# EAGLE design templog3 (EAGLE 9.5.1)
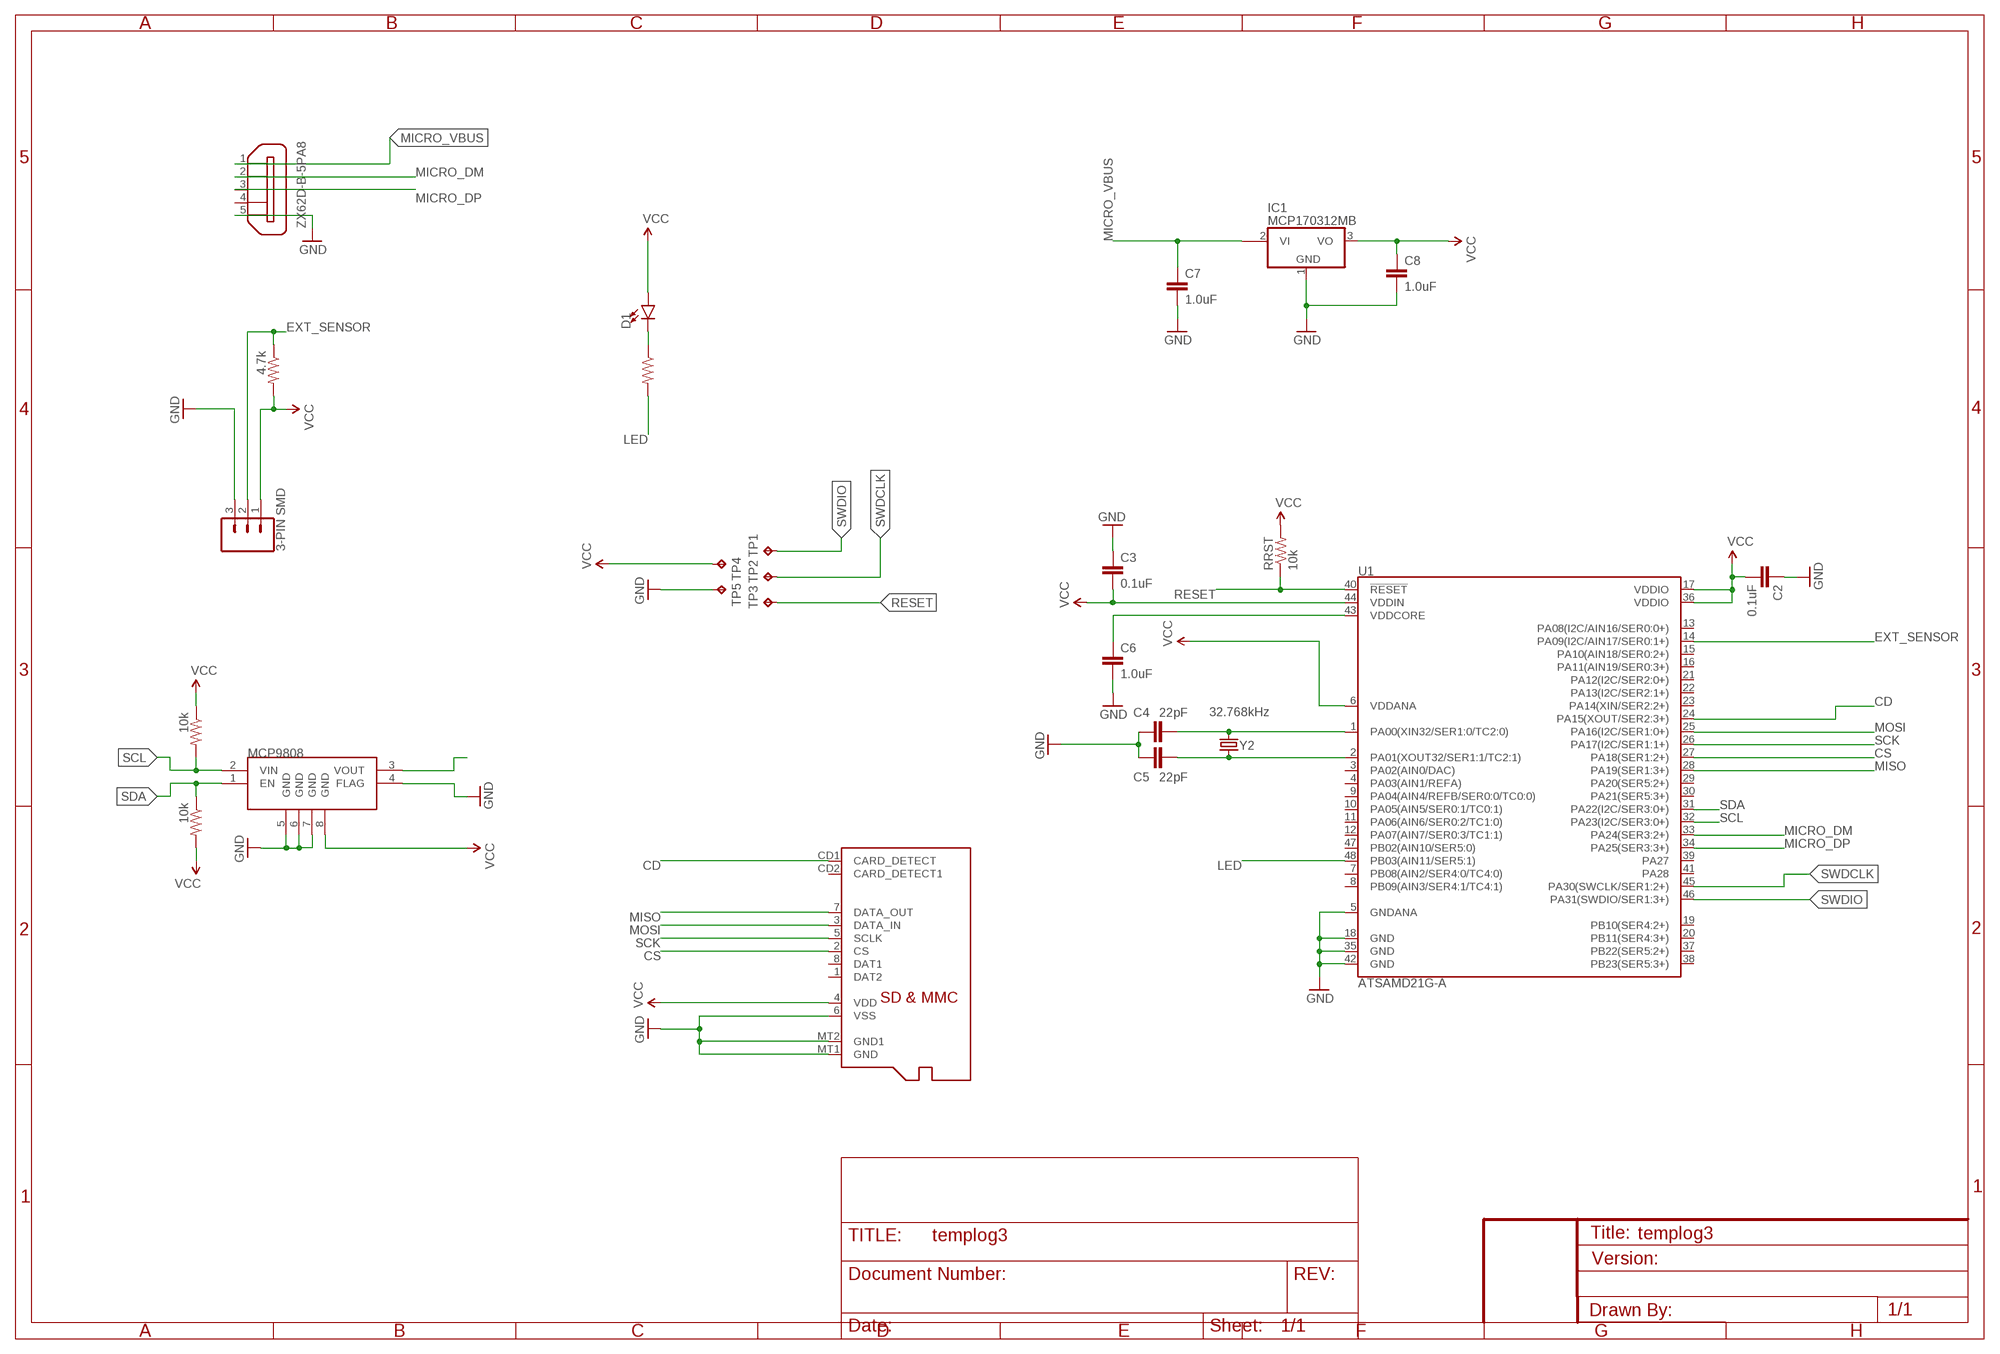
[diagram p0: schematic, sheet 1]

## Parts
C2  0.1uF  1.0UF-0805-25V-10%  [0805]
C3  0.1uF  1.0UF-0805-25V-10%  [0805]
C4  22pF  CAP0805  [0805]
C5  22pF  CAP0805  [0805]
C6  1.0uF  1.0UF-0805-25V-10%  [0805]
C7  1.0uF  1.0UF-0805-25V-10%  [0805]
C8  1.0uF  1.0UF-0805-25V-10%  [0805]
D1  LED1206  [LED-1206]
IC1  MCP170312MB  [SOT89]
J2  3-PIN SMD  CONN_03JST-SMD  [JST-3-SMD]
MCP9808  V_REG_MIC5216  [MSOP8]
R_I2C_1  10k  RESISTOR0805-RES  [0805]
R_I2C_2  10k  RESISTOR0805-RES  [0805]
R_I2C_3  4.7k  RESISTOR0805-RES  [0805]
R_I2C_4  RESISTOR0805-RES  [0805]
RRST  10k  RESISTOR0805-RES  [0805]
TP1  TPB1,27  [B1,27]
TP2  TPB1,27  [B1,27]
TP3  TPB1,27  [B1,27]
TP4  TPB1,27  [B1,27]
TP5  TPB1,27  [B1,27]
U1  ATSAMD21G-A  [TQFP-48]
U$1  MICROSD  [MICROSD]
X2  ZX62D-B-5PA8  [ZX62D-B-5PA8]
Y2  32.768kHz  CRYSTAL3.2X1.5MM  [CRYSTAL-SMD-3.2X1.5MM]

## Nets
CD: U1.24(PA15(XOUT/SER2:3+)) U$1.CD1(CARD_DETECT)
CS: U1.27(PA18(SER1:2+)) U$1.2(CS)
EXT_SENSOR: J2.2 R_I2C_3.1 U1.14(PA09(I2C/AIN17/SER0:1+))
GND: C2.1 C3.1 C4.1 C5.1 C6.2 C7.2 C8.2 IC1.1(GND) J2.3 MCP9808.4(FLAG) MCP9808.5(GND) MCP9808.6(GND) MCP9808.7(GND) TP5.TP U1.5(GNDANA) U1.18(GND) U1.35(GND) U1.42(GND) U$1.6(VSS) U$1.MT1(GND) U$1.MT2(GND1) X2.5
LED: R_I2C_4.2 U1.48(PB03(AIN11/SER5:1))
MICRO_DM: U1.33(PA24(SER3:2+)) X2.2
MICRO_DP: U1.34(PA25(SER3:3+)) X2.3
MICRO_VBUS: C7.1 IC1.2@1(VI1) X2.1
MISO: U1.28(PA19(SER1:3+)) U$1.7(DATA_OUT)
MOSI: U1.25(PA16(I2C/SER1:0+)) U$1.3(DATA_IN)
N$1: C6.1 U1.43(VDDCORE)
N$4: MCP9808.3(VOUT)
N$5: D1.C R_I2C_4.1
N$8: C4.2 U1.1(PA00(XIN32/SER1:0/TC2:0)) Y2.P$2
N$32: C5.2 U1.2(PA01(XOUT32/SER1:1/TC2:1)) Y2.P$1
RESET: RRST.1 TP3.TP U1.40(!RESET!)
SCK: U1.26(PA17(I2C/SER1:1+)) U$1.5(SCLK)
SCL: MCP9808.2(VIN) R_I2C_1.2 U1.32(PA23(I2C/SER3:0+))
SDA: MCP9808.1(EN) R_I2C_2.1 U1.31(PA22(I2C/SER3:0+))
SWDCLK: TP2.TP U1.45(PA30(SWCLK/SER1:2+))
SWDIO: TP1.TP U1.46(PA31(SWDIO/SER1:3+))
VCC [power]: C2.2 C3.2 C8.1 D1.A IC1.3(VO) J2.1 MCP9808.8(GND) R_I2C_1.1 R_I2C_2.2 R_I2C_3.2 RRST.2 TP4.TP U1.6(VDDANA) U1.17(VDDIO) U1.36(VDDIO) U1.44(VDDIN) U$1.4(VDD)
Unconnected: IC1.2(VI) U1.3(PA02(AIN0/DAC)) U1.4(PA03(AIN1/REFA)) U1.7(PB08(AIN2/SER4:0/TC4:0)) U1.8(PB09(AIN3/SER4:1/TC4:1)) U1.9(PA04(AIN4/REFB/SER0:0/TC0:0)) U1.10(PA05(AIN5/SER0:1/TC0:1)) U1.11(PA06(AIN6/SER0:2/TC1:0)) U1.12(PA07(AIN7/SER0:3/TC1:1)) U1.13(PA08(I2C/AIN16/SER0:0+)) U1.15(PA10(AIN18/SER0:2+)) U1.16(PA11(AIN19/SER0:3+)) U1.19(PB10(SER4:2+)) U1.20(PB11(SER4:3+)) U1.21(PA12(I2C/SER2:0+)) U1.22(PA13(I2C/SER2:1+)) U1.23(PA14(XIN/SER2:2+)) U1.29(PA20(SER5:2+)) U1.30(PA21(SER5:3+)) U1.37(PB22(SER5:2+)) U1.38(PB23(SER5:3+)) U1.39(PA27) U1.41(PA28) U1.47(PB02(AIN10/SER5:0)) U$1.1(DAT2) U$1.8(DAT1) U$1.CD2(CARD_DETECT1) X2.4 X2.S1 X2.S2 X2.S3 X2.S4

## Library data of the parts
C2 C3 = SparkFun-Capacitors:1.0UF: 1µF ceramic capacitors A capacitor is a passive two-terminal electrical component used to store electrical energy temporarily in an electric field.; PROD_ID: CAP-08064; VALUE: 1.0uF
C4 C5 = SparkFun-Passives:CAP: Capacitor Standard 0603 ceramic capacitor, and 0.1" leaded capacitor.
C6-C8 = SparkFun-Capacitors:1.0UF: 1µF ceramic capacitors A capacitor is a passive two-terminal electrical component used to store electrical energy temporarily in an electric field.; PROD_ID: CAP-08064
D1 = SparkFun-LED:LED: LED (Generic) Standard schematic elements and footprints for 5mm, 3mm, 1206, and 0603 sized LEDs. Generic LEDs with no color specified.
IC1 = linear:MCP1703*: 250 mA, 16V, Low Quiescent Current LDO Regulator Source: http://ww1.microchip.com/downloads/en/DeviceDoc/22049b.pdf
J2 = SparkFun-Connectors:CONN_03: Multi connection point. Often used as Generic Header-pin footprint for 0.1 inch spaced/style header connections On any of the 0.1 inch spaced packages, you can populate with these: Break Away Headers - Straight <https://www.sparkfun.com/products/116> (PRT-00116) Break Away Male Headers - Right Angle <https://www.sparkfun.com/products/553> (PRT-00553) Female Headers <https://www.sparkfun.com/products/115> (PRT-00115) Break Away Headers - Machine Pin <https://www.sparkfun.com/products/117> (PRT-00117) Break Away Female Headers - Swiss Machine Pin <https://www.sparkfun.com/products/743> (PRT-00743) Stackable Header - 3 Pin (Female, 0.1") <https://www.sparkfun.com/products/13875> (PRT-13875) For SCREWTERMINALS and SPRING TERMINALS visit here: Screw Terimnals on SparkFun.com <https://www.sparkfun.com/search/results?term=Screw+Terminals> (5mm/3.5mm/2.54mm spacing) This device is also useful as a general connection point to wire up your design to another part of your project. Our various solder wires solder well into these plated through hole pads. Hook-Up Wire - Assortment (Stranded, 22 AWG) <https://www.sparkfun.com/products/11375> (PRT-11375) Hook-Up Wire - Assortment (Solid Core, 22 AWG) <https://www.sparkfun.com/products/11367> (PRT-11367) View the entire wire category on our website here <https://www.sparkfun.com/categories/141> Special notes: Molex polarized connector foot print use with SKU : PRT-08232 with associated crimp pins and housings.; PROD_ID: CONN-12591
MCP9808 = SparkFun-IC-Power:V_REG_MIC5216: 500mA LDO, MSOP8 for better dissipation; PROD_ID: IC-09527
R_I2C_1-R_I2C_4 RRST = SparkFun-Passives:RESISTOR: Resistor Basic schematic elements and footprints for 0603, 1206, and PTH resistors.
TP1-TP5 = testpad:TP: Test pad
U1 = SparkFun-IC-Microcontroller:ATSAMD21G: Atmel SAMD21G SMART ARM-Based Microcontroller The Atmel ® | SMART ™ SAM D21 is a series of low-power microcontrollers using the 32-bit ARM ® Cortex ® -M0+ processor, and ranging from 32- to 64-pins with up to 256KB Flash and 32KB of SRAM. The SAM D21 devices operate at a maximum frequency of 48MHz and reach 2.46 CoreMark/MHz. They are designed for simple and intuitive migration with identical peripheral modules, hex compatible code, identical linear address map and pin compatible migration paths between all devices in the product series. All devices include intelligent and flexible peripherals, Atmel Event System for inter-peripheral signaling, and support for capacitive touch button, slider and wheel user interfaces. Datasheet <https://cdn.sparkfun.com/datasheets/Dev/Arduino/Boards/Atmel-42181-SAM-D21_Datasheet.pdf> SparkFun Products SparkFun SAMD21 Mini Breakout <https://www.sparkfun.com/products/13664> (DEV-13664) SparkFun SAMD21 Dev Breakout <https://www.sparkfun.com/products/13672> (DEV-13672); PROD_ID: IC-13064
U$1 = adafruit:MICROSD: Micro-SD / Transflash card holder with SPI pinout For the 3M # 2908-05WB-MG and/or 4UCON #19656 push-push type
X2 = zx62d-b-5pa8-oshpark_10:ZX62D-B-5PA8: Micro USB Type B Connector - Standard, Shell Through Hole Source: http://www.hirose.co.jp/cataloge_hp/ed_ZX_20140804.pdf; MF: Hirose; MPN: ZX62D-B-5PA8; OC_FARNELL: 2300438; OC_NEWARK: 69W0712
Y2 = samd21-temp:CRYSTAL: Various standard crystals. Proven footprints.; PROD_ID: XTAL-13062

## Net classes
0 default: width 0.203 mm, clearance 0.152 mm
1 power: width 0.254 mm, clearance 0.203 mm
2 camera_power: width 0.66 mm, clearance 0.254 mm
3 usbsignal: width 0.254 mm, clearance 0.203 mm
4 highpower: clearance 0.305 mm

## Board
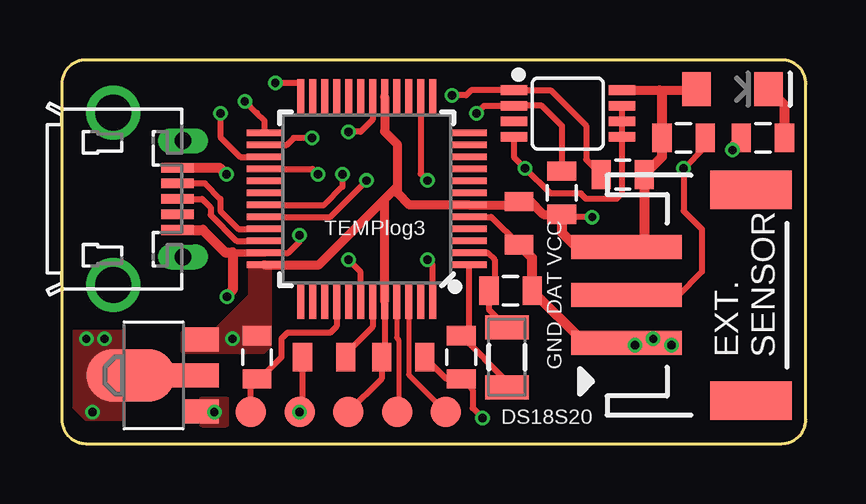
[diagram p1: board, top side]
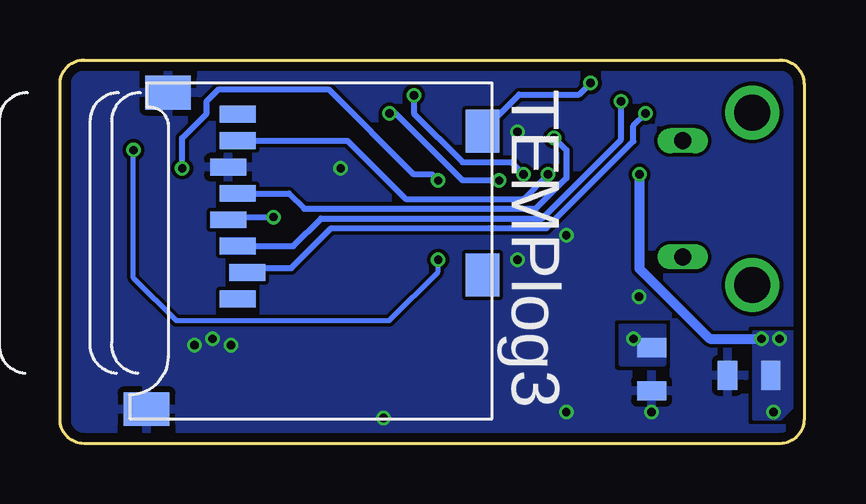
[diagram p2: board, bottom side, seen from below]

Size 31 x 16 mm. Coordinates in mm from the lower left corner, seen from the top.
Outline: 1,0 30,0 arc90 31,1 31,15 arc90 30,16 1,16 arc90 0,15 0,1 arc90 1,0
Copper layers (1*16): Top 0.035559375mm / dielectric 1.6mm / Bottom 0.035559375mm
Design rules "oshpark-2layer": minimum track width 6mil, minimum drill 10mil, track to track 6mil, track to pad 6mil, pad to pad 6mil, via to via 6mil, smd to smd 6mil, copper to edge 15mil, drill to drill 6mil, minimum pad ring 5mil, minimum via ring 5mil, stop-mask expansion 2.5mil, vias tented up to drill 0mil, thermal gap 10mil

### Footprints (pad centres in the part's own frame; a part is rotated, then mirrored left to right if it is on the bottom)
0805 = smd 0.8 x 1.2: 1 -0.9,0; 2 0.9,0
LED-1206 = smd 1.2 x 1.4: A -1.5,0; C 1.5,0
SOT89 = smd 1 x 1.5: 1 -1.499,-1.981; 3 1.499,-1.981 | smd 1 x 2: 2 0,-1.727 | smd 2.2 x 3.7: 2@1 0,0.94
JST-3-SMD = smd 1 x 4.6: 1 -1.99,-4.77; 2 0.01,-4.77; 3 2.01,-4.77 | smd 1.6 x 3.4: NC1 -4.39,0.43; NC2 4.41,0.43
MSOP8 = smd 0.4 x 1.1: 1 -0.975,-2.25; 2 -0.325,-2.25; 3 0.325,-2.25; 4 0.975,-2.25; 5 0.975,2.25; 6 0.325,2.25; 7 -0.325,2.25; 8 -0.975,2.25
B1,27 = smd 1.27 x 1.27: TP 0,0
TQFP-48 = smd 1.5 x 0.28: 1 -4.25,2.75; 2 -4.25,2.25; 3 -4.25,1.75; 4 -4.25,1.25; 5 -4.25,0.75; 6 -4.25,0.25; 7 -4.25,-0.25; 8 -4.25,-0.75; 9 -4.25,-1.25; 10 -4.25,-1.75; 11 -4.25,-2.25; 12 -4.25,-2.75; 25 4.25,-2.75; 26 4.25,-2.25; 27 4.25,-1.75; 28 4.25,-1.25; 29 4.25,-0.75; 30 4.25,-0.25; 31 4.25,0.25; 32 4.25,0.75; 33 4.25,1.25; 34 4.25,1.75; 35 4.25,2.25; 36 4.25,2.75 | smd 0.28 x 1.5: 13 -2.75,-4.25; 14 -2.25,-4.25; 15 -1.75,-4.25; 16 -1.25,-4.25; 17 -0.75,-4.25; 18 -0.25,-4.25; 19 0.25,-4.25; 20 0.75,-4.25; 21 1.25,-4.25; 22 1.75,-4.25; 23 2.25,-4.25; 24 2.75,-4.25; 37 2.75,4.25; 38 2.25,4.25; 39 1.75,4.25; 40 1.25,4.25; 41 0.75,4.25; 42 0.25,4.25; 43 -0.25,4.25; 44 -0.75,4.25; 45 -1.25,4.25; 46 -1.75,4.25; 47 -2.25,4.25; 48 -2.75,4.25
MICROSD = smd 0.7 x 1.5: 1 9,-10.64; 2 7.9,-10.24; 3 6.8,-10.64; 4 5.7,-11.04; 5 4.6,-10.64; 6 3.5,-11.04; 7 2.4,-10.64; 8 1.3,-10.64 | smd 1.8 x 1.4: CD1 2,-0.44; CD2 8,-0.44 | smd 1.4 x 1.9: MT1 0.4,-13.54; MT2 13.6,-14.44
ZX62D-B-5PA8 = smd 1.35 x 0.4: 1 4.825,1.3; 2 4.825,0.65; 3 4.825,0; 4 4.825,-0.65; 5 4.825,-1.3 | drill 1.5: S1 2.15,-3.6; S2 2.15,3.6 | drill 0.7 long: S3 5.05,2.425; S4 5.05,-2.425
CRYSTAL-SMD-3.2X1.5MM = smd 1 x 1.8: P$1 -1.25,0; P$2 1.25,0

### Placement (x,y rotation side)
C2  14.22,3.6 180 top
C3  19.05,9.19 90 top
C4  16.64,3.6 90 top
C5  18.7,6.37 180 top
C6  10.92,3.6 180 top
C7  2.29,2.84 180 bottom
C8  6.35,3.1 270 bottom
D1  27.94,14.78 0 top
IC1  3.81,2.84 90 top
J2  28.29,6.2 270 top
MCP9808  21.08,13.76 270 top
R_I2C_1  20.83,10.46 90 top
R_I2C_2  23.37,11.22 0 top
R_I2C_3  25.91,12.75 180 top
R_I2C_4  29.21,12.75 180 top
RRST  8.13,3.6 90 top
TP1  16,1.32 180 top
TP2  13.97,1.32 180 top
TP3  7.87,1.32 180 top
TP4  11.94,1.32 180 top
TP5  9.91,1.32 180 top
U1  12.7,10.21 180 top
U$1  12.95,15.03 270 bottom
X2  0,10.21 0 top
Y2  18.54,3.6 270 top

### Tracks (layer width: path | path; a pad name or v marks a point on that pad's centre or on a via)
CD  (via drill 0.35)
  Top 0.254: U1.24 9.95,15.03 v8.89,15.03
  Bottom 0.254: v8.89,15.03 9.37,14.56 11.87,14.56 U$1.CD1
CS  (via drill 0.35)
  Top 0.254: v6.6,13.76 6.6,12.78 7.43,11.96 U1.27
  Bottom 0.254: U$1.2 23.01,7.32 21.36,7.32 19.69,8.99 10.74,8.99 7.11,12.62 7.11,13.26 v6.6,13.76
EXT_SENSOR  (via drill 0.35)
  Top 0.254: U1.14 14.95,11.26 v15.24,10.97 | R_I2C_3.1 26.81,12.38 v25.91,11.48 25.91,9.7 26.67,8.94 26.67,7.16 25.65,6.14 23.56,6.14 J2.2
  Bottom 0.254: v15.24,10.97 15.49,11.22 16.26,11.22 19.81,14.78 24.38,14.78 24.89,14.27 24.89,13.76 25.91,12.75 v25.91,11.48
GND  (via drill 0.35)
  Top 0.254: C6.2 10.02,1.43 TP5.TP | U1.42 12.45,7.16 v11.94,7.67 | MCP9808.7 MCP9808.6 MCP9808.5 23.33,10.43 23.11,10.21 21.84,10.21 21.62,10.43 20.37,10.43 19.32,11.48 v19.3,11.48 18.83,11.95 MCP9808.4 | U1.5 17.88,9.46 C3.1 | C2.1 16.02,2.7 C4.1 17.11,2.23 17.11,1.48 v17.53,1.06 | U1.35 9.43,7.96 9.91,8.43 v9.91,8.68 | U1.18 12.95,13.51 12.45,13 v11.94,13
  Top 0.305: U1.35 7.13,7.96 7.11,7.97
  Top 0.406: X2.5 5.87,8.91 6.8,7.97 7.11,7.97 7.11,6.4 6.87,6.16 v6.87,6.13 | C3.1 19.6,7.75 C5.1 21.78,4.19 J2.3 23.8,4.19 v23.88,4.11
  other vias: 9.91,1.32 6.35,1.32 25.4,4.11 24.64,4.37
  pour Bottom (rank 2): 0,0.3 31.5,0.3 31.5,15.8 0,15.8
  pour Top (no thermals): 5.84,1.83 5.84,0.81 6.86,0.81 6.86,1.83
LED  (via drill 0.35)
  Top 0.254: U1.48 15.45,7.46 v15.24,7.67 | v27.94,12.24 27.94,12.49 28.19,12.75
  Top 0.406: 28.19,12.75 R_I2C_4.2
  Bottom 0.203: v27.94,12.24 27.94,6.91 26.16,5.13 17.27,5.13 15.24,7.16 v15.24,7.67
MICRO_DM
  Top 0.254: X2.2 5.95,10.86 6.6,10.21 6.6,9.7 7.35,8.96 U1.33
MICRO_DP
  Top 0.254: X2.3 5.84,10.21 6.2,9.85 6.2,9.53 7.27,8.46 U1.34
MICRO_VBUS  (via drill 0.35)
  Top 0.406: X2.1 6.57,11.51 v6.86,11.22
  Bottom 0.406: v6.86,11.22 6.86,7.3 3.93,4.37 v1.78,4.37
  other vias: 1.02,4.37 1.27,1.32
  pour Top (no thermals): 2.54,1.06 2.54,4.62 0.51,4.62 0.51,1.57 1.02,1.06
  pour Bottom (no thermals): 0.51,4.62 0.51,1.57 1.02,1.06 2.03,1.06 2.03,4.62
MISO  (via drill 0.35)
  Top 0.254: U1.28 10.43,11.46 v10.67,11.22
  Bottom 0.254: U$1.7 19.02,12.63 16.6,10.21 11.68,10.21 v10.67,11.22
MOSI  (via drill 0.35)
  Top 0.254: U1.25 8.45,13.47 8.13,13.79 8.1,13.79 v7.62,14.27
  Bottom 0.254: U$1.3 21.28,8.23 20.12,9.39 10.91,9.39 7.62,12.68 v7.62,14.27
N$1
  Top 0.254: U1.43 12.95,4.87 11.82,3.74 C6.1
N$5
  Top 0.406: R_I2C_4.1 30.11,14.11 D1.C
N$8
  Top 0.254: U1.1 16.95,4.82 C4.2 18.54,2.6 Y2.P$2
N$32
  Top 0.254: U1.2 17.74,7.96 18.03,7.67 18.03,6.61 C5.2 17.8,5.6 Y2.P$1
RESET
  Top 0.254: U1.40 11.45,4.89 11.18,4.62 9.4,4.62 9.14,4.37 9.14,3.6 8.24,2.7 RRST.1 7.87,2.45 TP3.TP
SCK  (via drill 0.35)
  Top 0.254: U1.26 9.36,12.46 9.65,12.75 v10.41,12.75
  Bottom 0.254: U$1.5 21.46,10.43 20.83,9.8 11.18,9.8 9.91,11.07 9.91,12.24 v10.41,12.75
SCL  (via drill 0.35)
  Top 0.254: U1.32 11.19,9.46 v12.7,10.97 | v17.27,13.76 17.6,14.09 MCP9808.2 20,14.09 20.83,13.26 R_I2C_1.2
  Bottom 0.254: v12.7,10.97 14.22,10.97 17.02,13.76 v17.27,13.76
SDA  (via drill 0.35)
  Top 0.254: U1.31 10.93,9.96 11.68,10.72 v11.68,11.22 | v16.26,14.53 16.84,14.53 17.05,14.74 MCP9808.1 20.36,14.74 21.84,13.26 21.84,11.85 R_I2C_2.1
  Bottom 0.254: v16.26,14.53 16.26,13.76 14.22,11.73 12.19,11.73 v11.68,11.22
SWDCLK
  Top 0.203: U1.45 13.95,4.41 14.03,4.33 14.03,1.38 TP2.TP
SWDIO
  Top 0.203: U1.46 14.45,2.87 TP1.TP
VCC  (via drill 0.35)
  Top 0.254: U1.44 13.45,3.73 C2.2 13.32,2.7 TP4.TP | R_I2C_1.1 20.94,9.45 v22.1,9.45
  Top 0.381: U1.36 10.71,7.46 13.45,10.2 | U1.44 13.45,10.2 | 13.45,10.2 13.97,10.72 | U1.17 13.45,13.01 13.97,12.49 13.97,10.72 | 13.97,10.72 13.97,10.46 14.47,9.96 U1.6 18.92,9.96 C3.2 19.54,10.09 20.07,9.56 R_I2C_1.1 | MCP9808.8 24.89,14.74 26.4,14.74 D1.A
  Top 0.406: 24.89,14.74 25.01,14.62 R_I2C_3.2 25.01,11.96 R_I2C_2.2 24.27,8.31 24.13,8.18 23.53,8.18 J2.1 21.44,8.19 20.83,8.8 R_I2C_1.1
  Bottom 0.254: U$1.4 23.88,9.45 v22.1,9.45
  other vias: 7.11,4.37
  pour Top (no thermals): 5.08,4.62 5.08,3.86 8.38,3.86 8.64,4.11 8.64,7.41 7.87,7.41 7.87,6.14 6.35,4.62
  pour Bottom (no thermals): 7.62,4.87 7.62,3.35 5.84,3.35 5.84,4.87

### Text on the board
tPlace: TEMPlog3 | VCC | DAT | EXT. | SENSOR | GND | DS18S20
bPlace: TEMPlog3